# Altium schematic sheet 485_tranceiver.SchDoc: RS485 Tranceiver
size Letter; Organization: OSURC Mars Rover; DocumentNumber: 1; Revision: 1; SheetNumber: 4; SheetTotal: 7
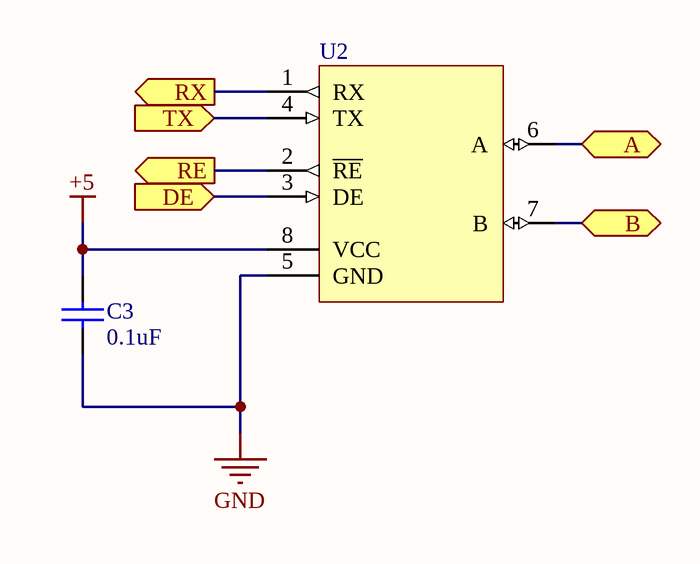
[diagram p0: 485_tranceiver.SchDoc]

## Parts
C3  0.1uF  [CAPC1608X90X35NL20T15]
U2  STMicroelectronics ST3485ECDR  [PCB-lmrwxhl2h1q3b67kej26-1]  (value not drawn)

## Ports
A (bidir), B (bidir), DE (in), RE (out), RX (out), TX (in)

## Nets
+5: C3.2 U2.8(VCC)
GND: C3.1 U2.5(GND)
A: U2.6(A) ; port A
B: U2.7(B) ; port B
DE: U2.3(DE) ; port DE
RE: U2.2(~{RE}) ; port RE
RX: U2.1(RX) ; port RX
TX: U2.4(TX) ; port TX

## Notes on the sheet
- Title
- Size:
- Date:
- Letter
- Number:
- Time:
- Revision:
- Sheet
- of
- File:

## Library data of the parts
C3 = CMP-120344-2: CAP CER 0.1UF 50V 10% X7R 0603; Capacitance: 1e-07 F; Lead-Free Status: Lead Free; Voltage Rating (DC): 50.0 V; Capacitance Tolerance: ±10%; Dielectric Characteristic: X7R; Octopart Url: https://octopart.com/gcj188r71h104ka12d-murata-20842003; OctopartID: aa306204894575f7; RoHS: Compliant
U2 = CMP-4f81868cdec19046-4: ST3485E Series 3.3 V ±15 kV ESD Protected RS-485/RS-422 Transceiver - SOIC-8; Supply Current: 2.20 mA; Data Rate: 15.0 Mbps; Lead-Free Status: Lead Free; Supply Voltage (DC): 3.00 V (min); Octopart URL: http://octopart.com/st3485ecdr-stmicroelectronics-504870; OctopartID: 4f81868cdec19046; Number of Pins: 8; Manufacturer Part Number: ST3485ECDR; Mounting Style: Surface Mount; Packaging: Cut Tape (CT); RoHS: Compliant; Case/Package: SOIC; REACH SVHC Compliance: No SVHC; Lifecycle Status: Active